# EAGLE schematic RADAR_Main_Board (EAGLE 7.4.0), part 3 of 3
## Sheet 4 of 4: RF POWER AMPLIFIER BIAS
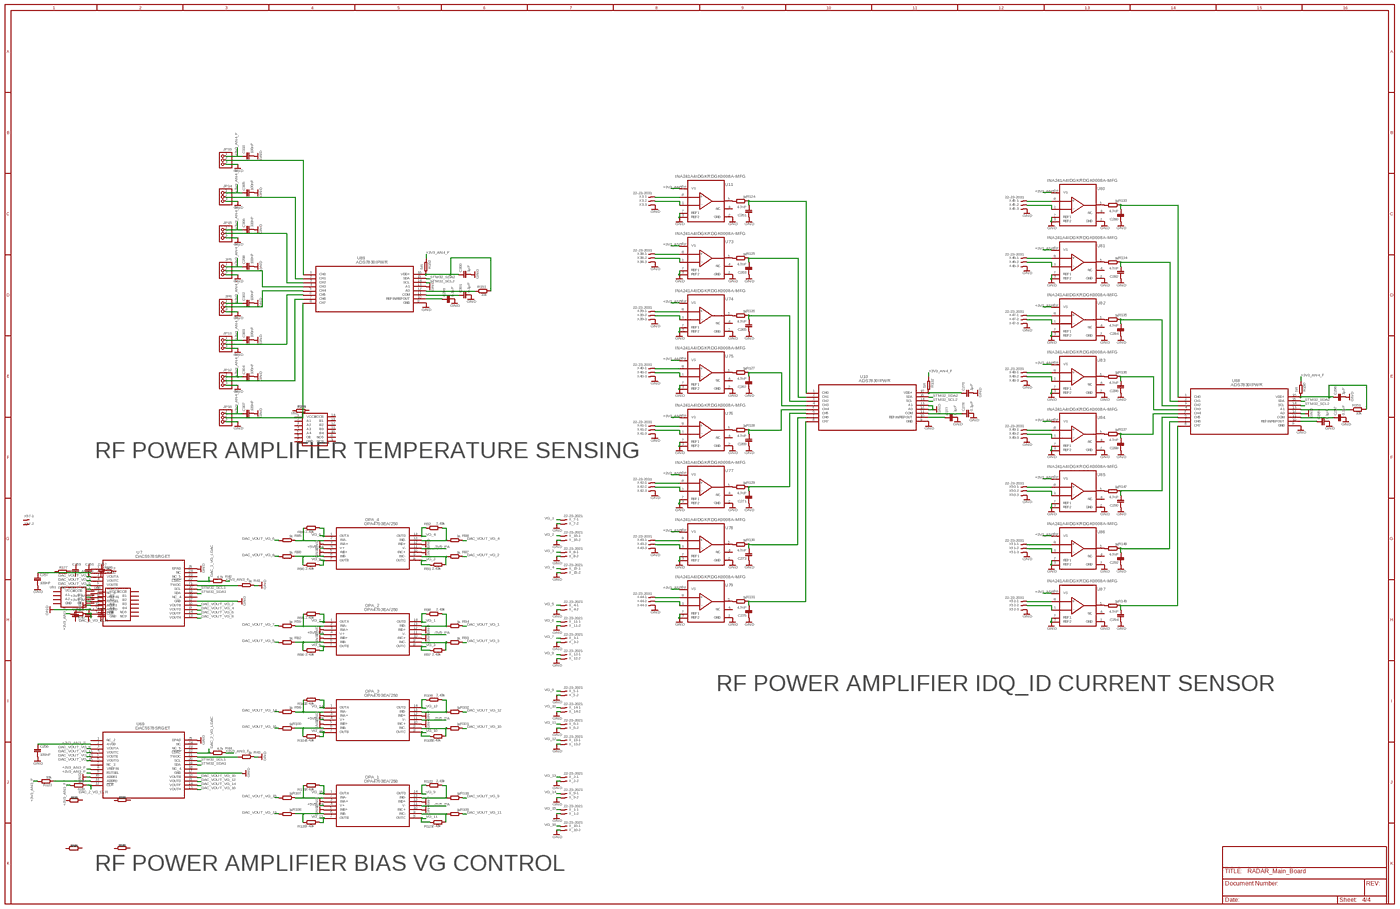
[diagram p16: schematic, sheet 4, overview]
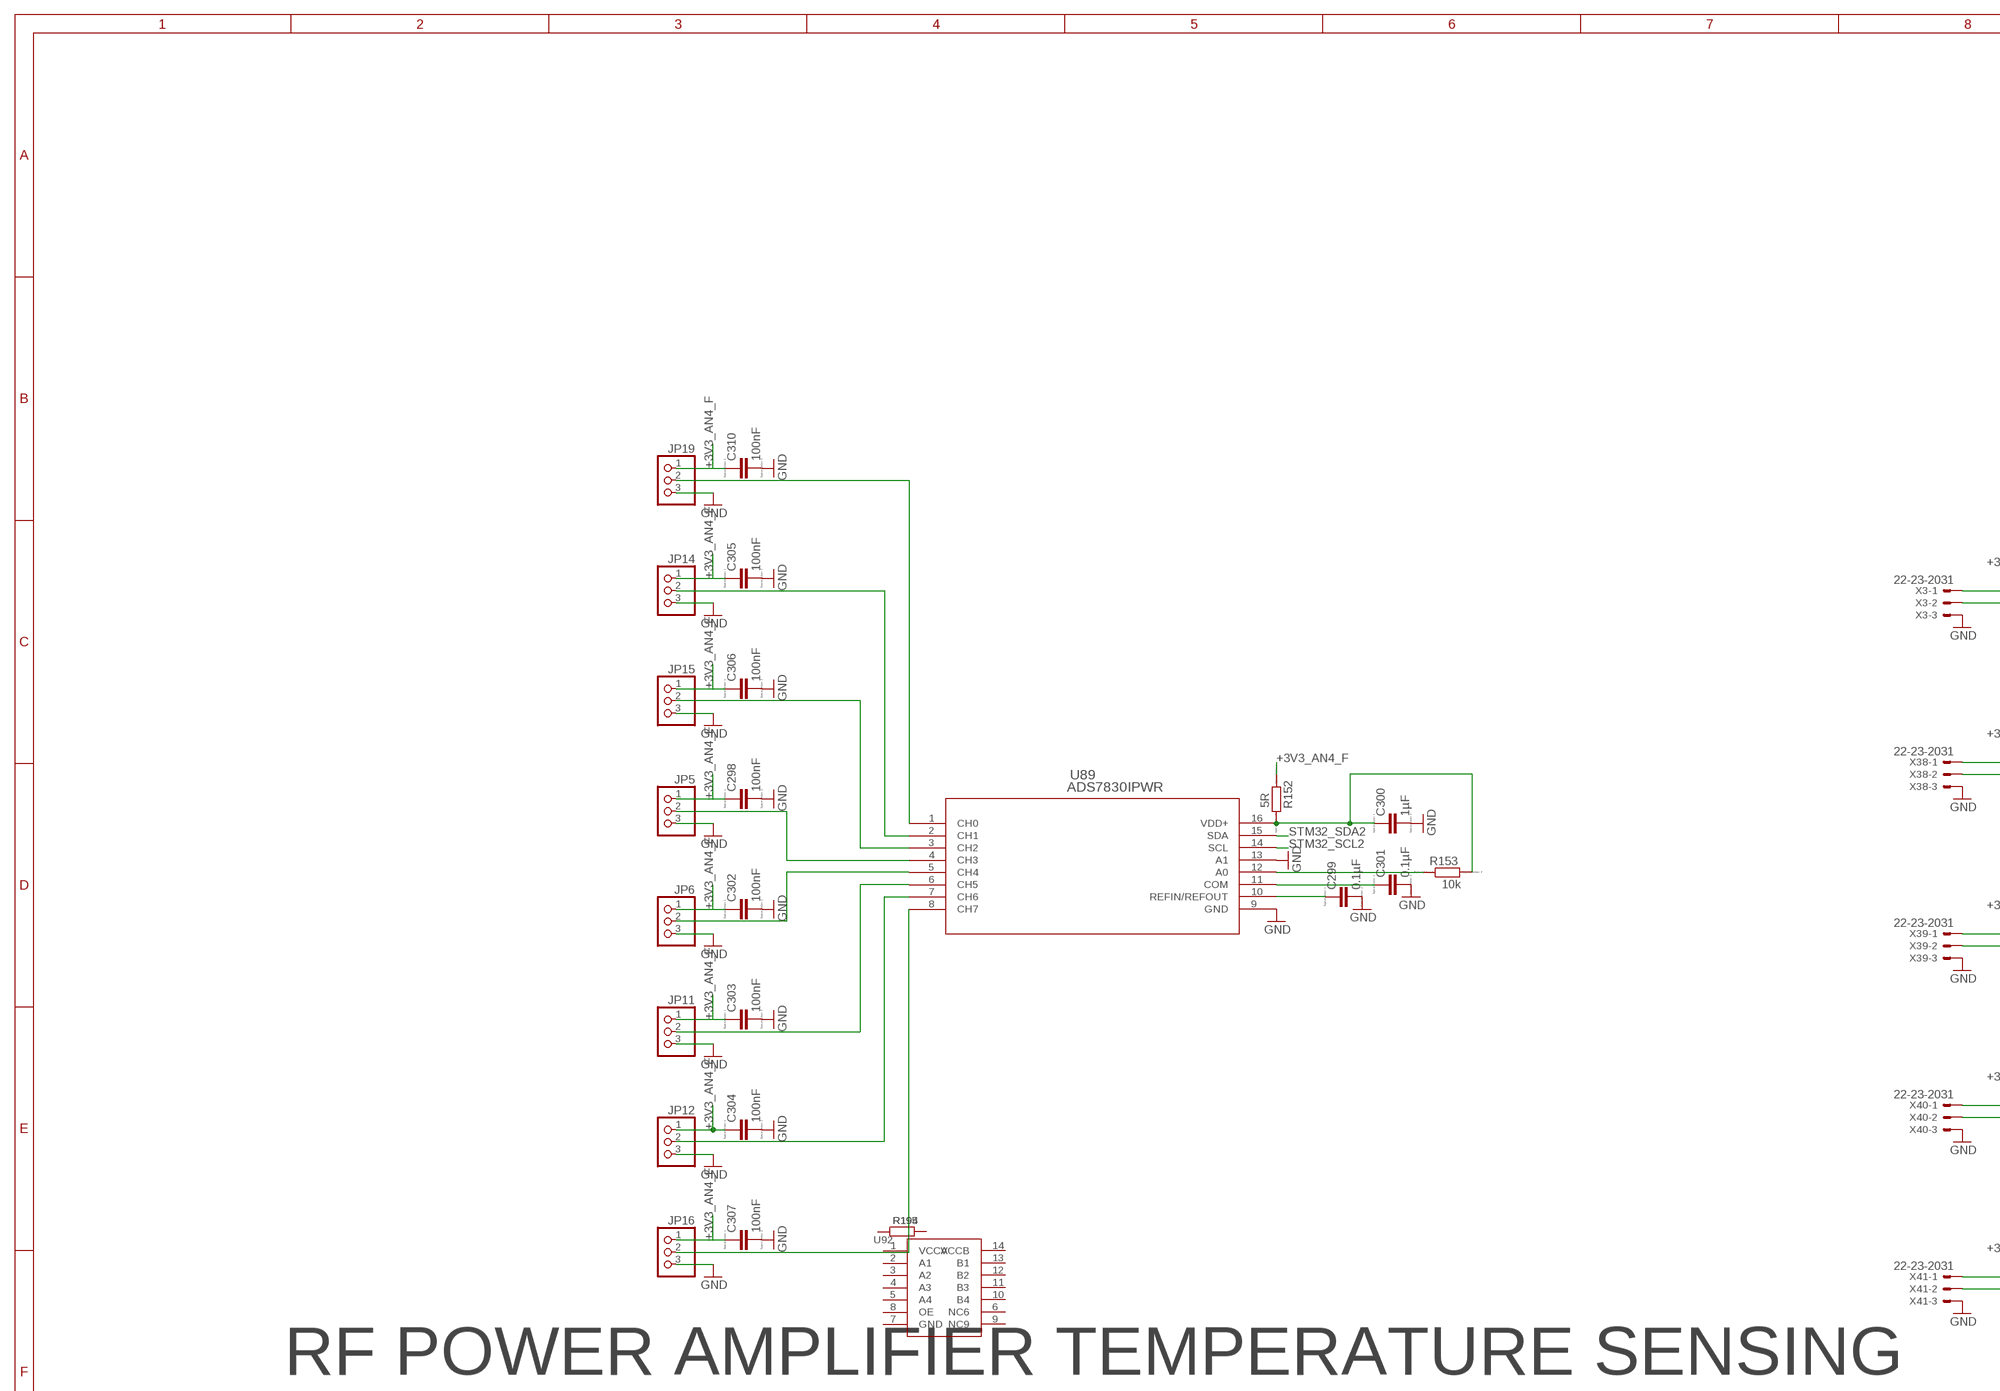
[diagram p17: schematic, sheet 4, part 1 of 4]
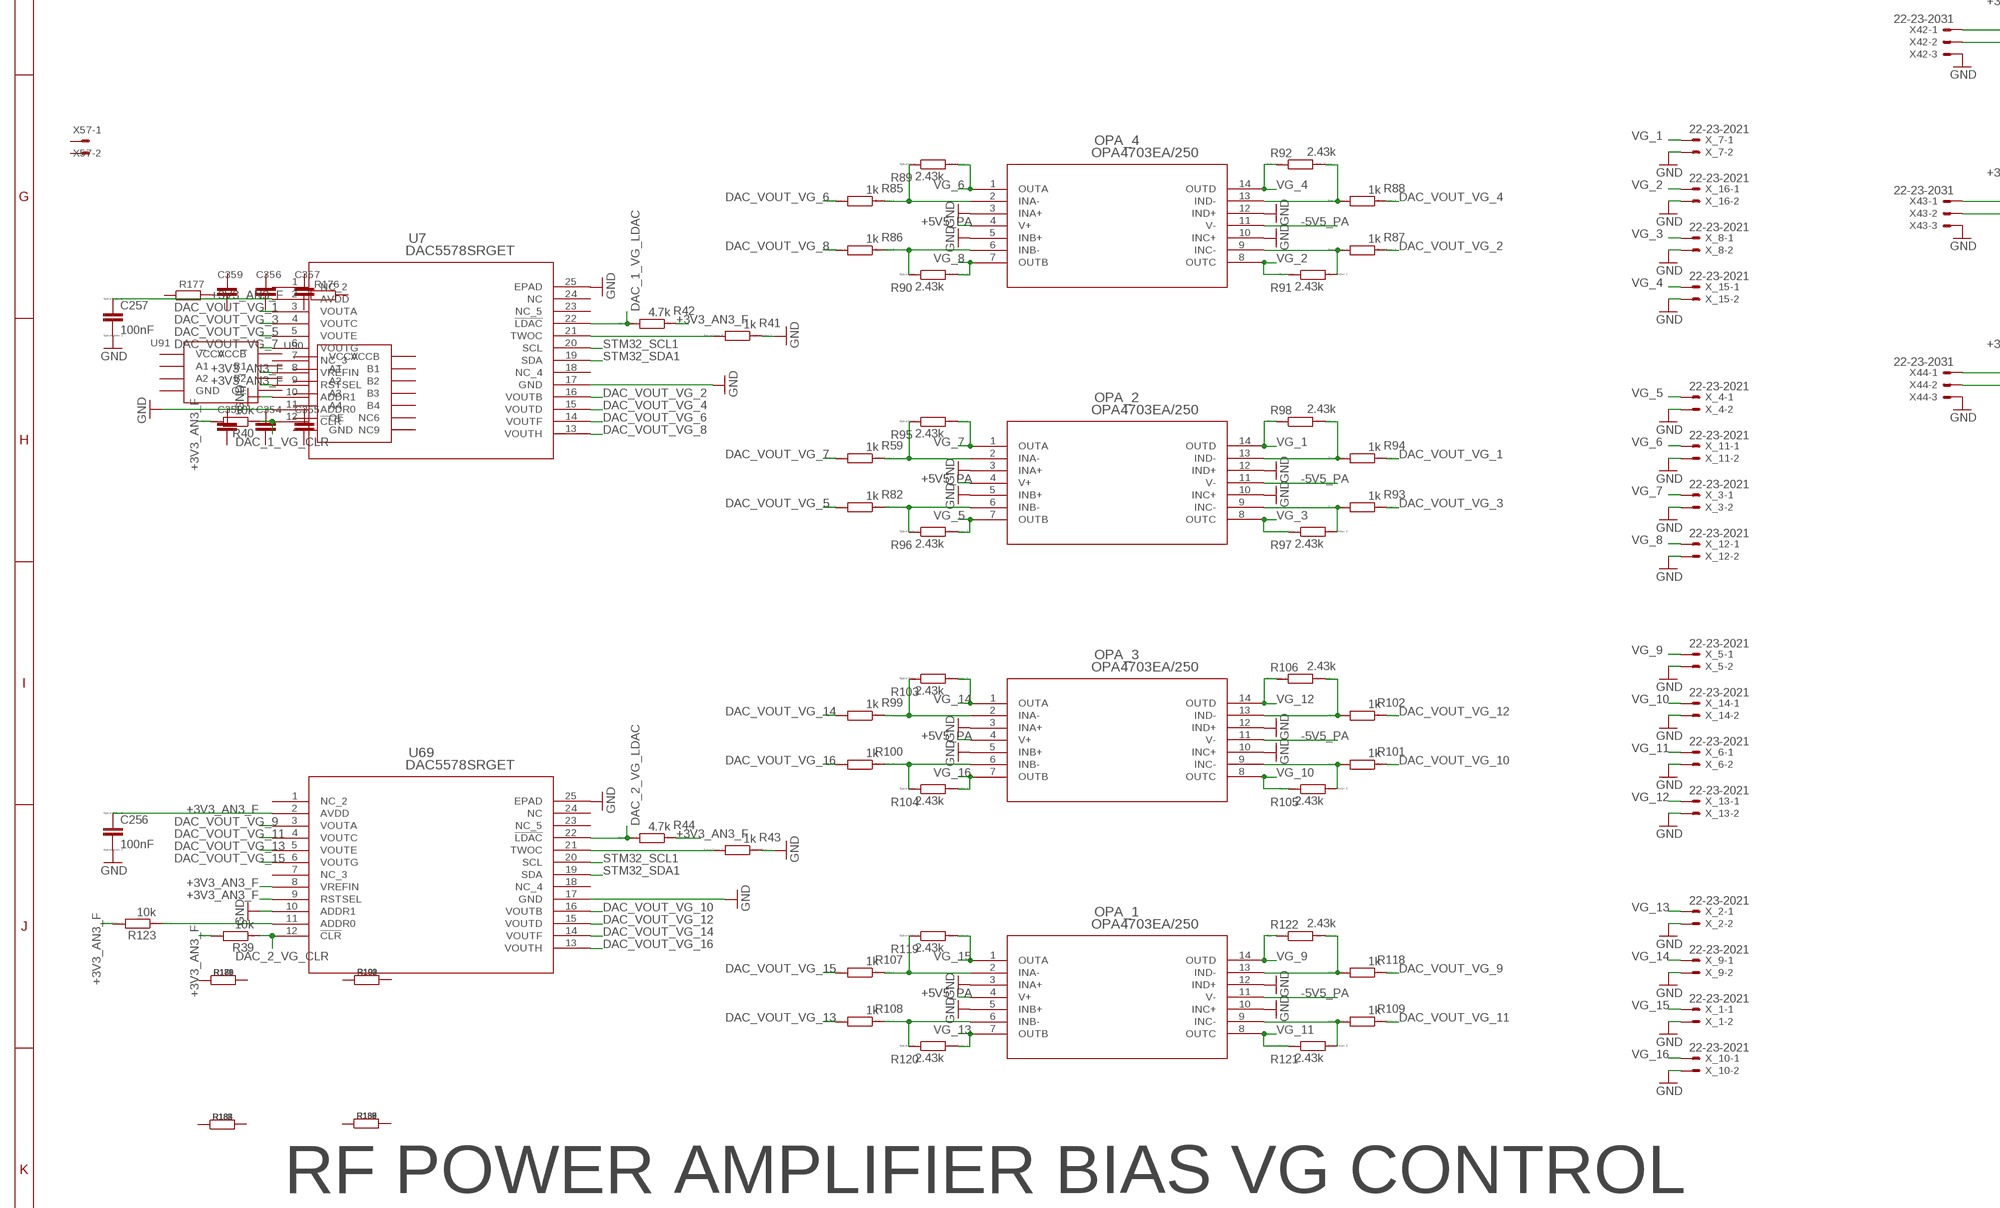
[diagram p18: schematic, sheet 4, part 2 of 4]
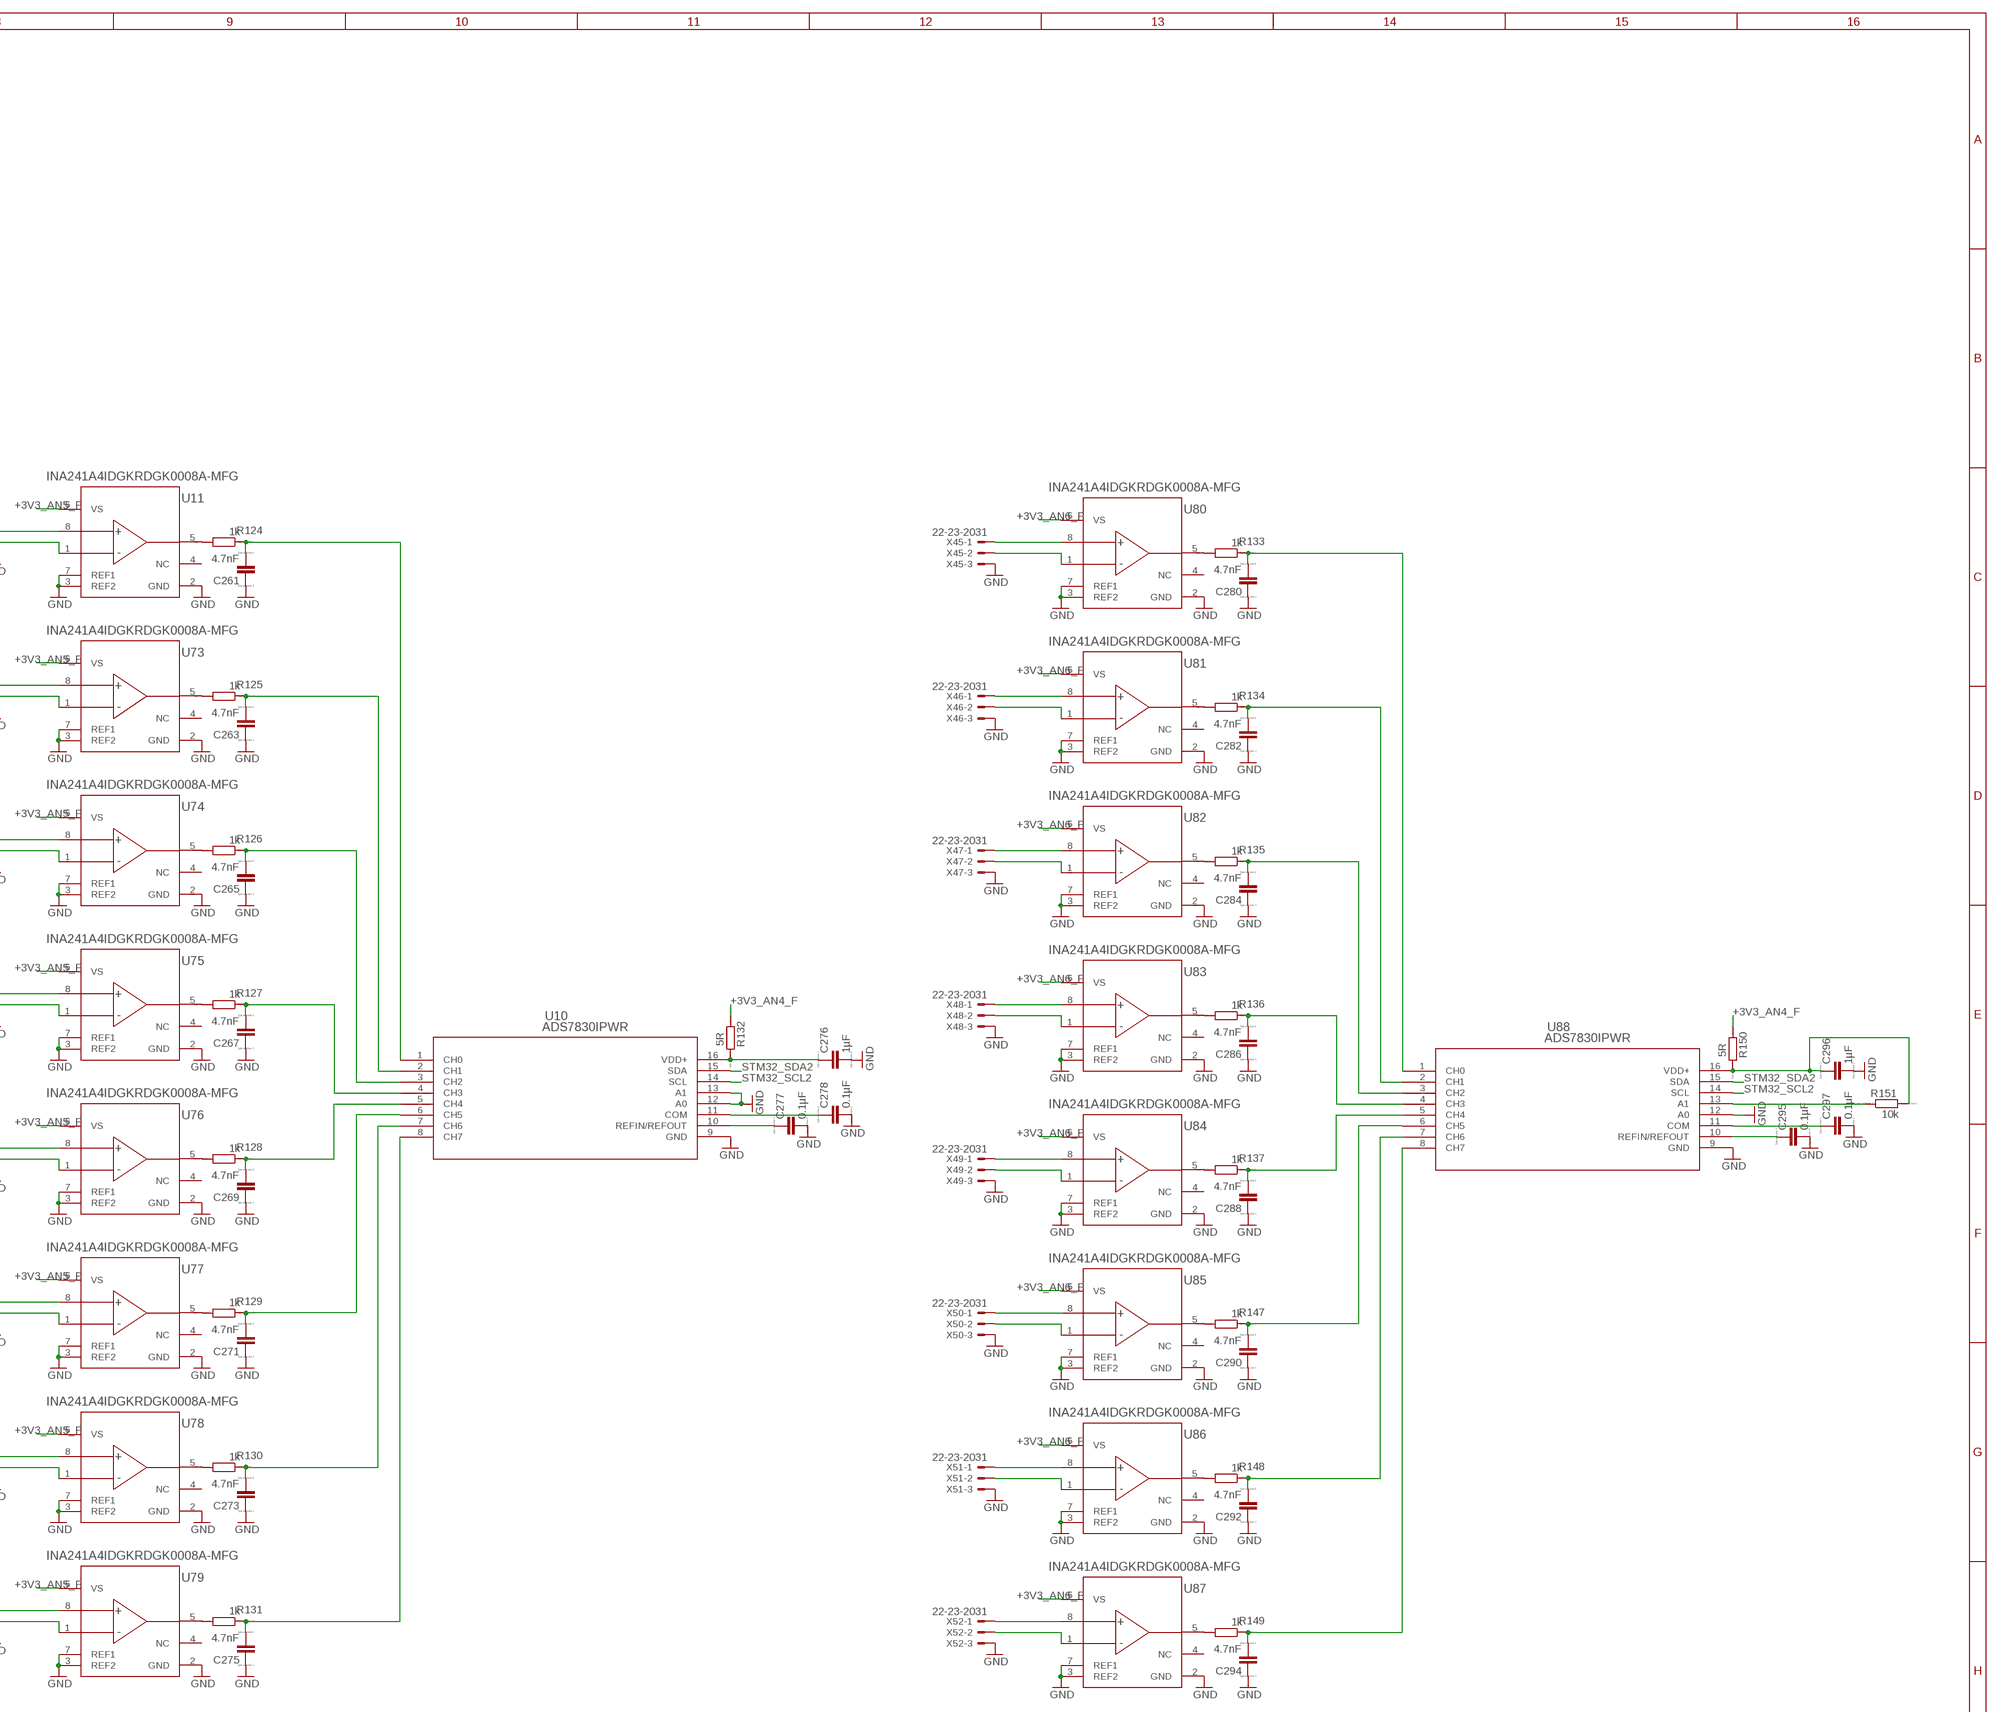
[diagram p19: schematic, sheet 4, part 3 of 4]
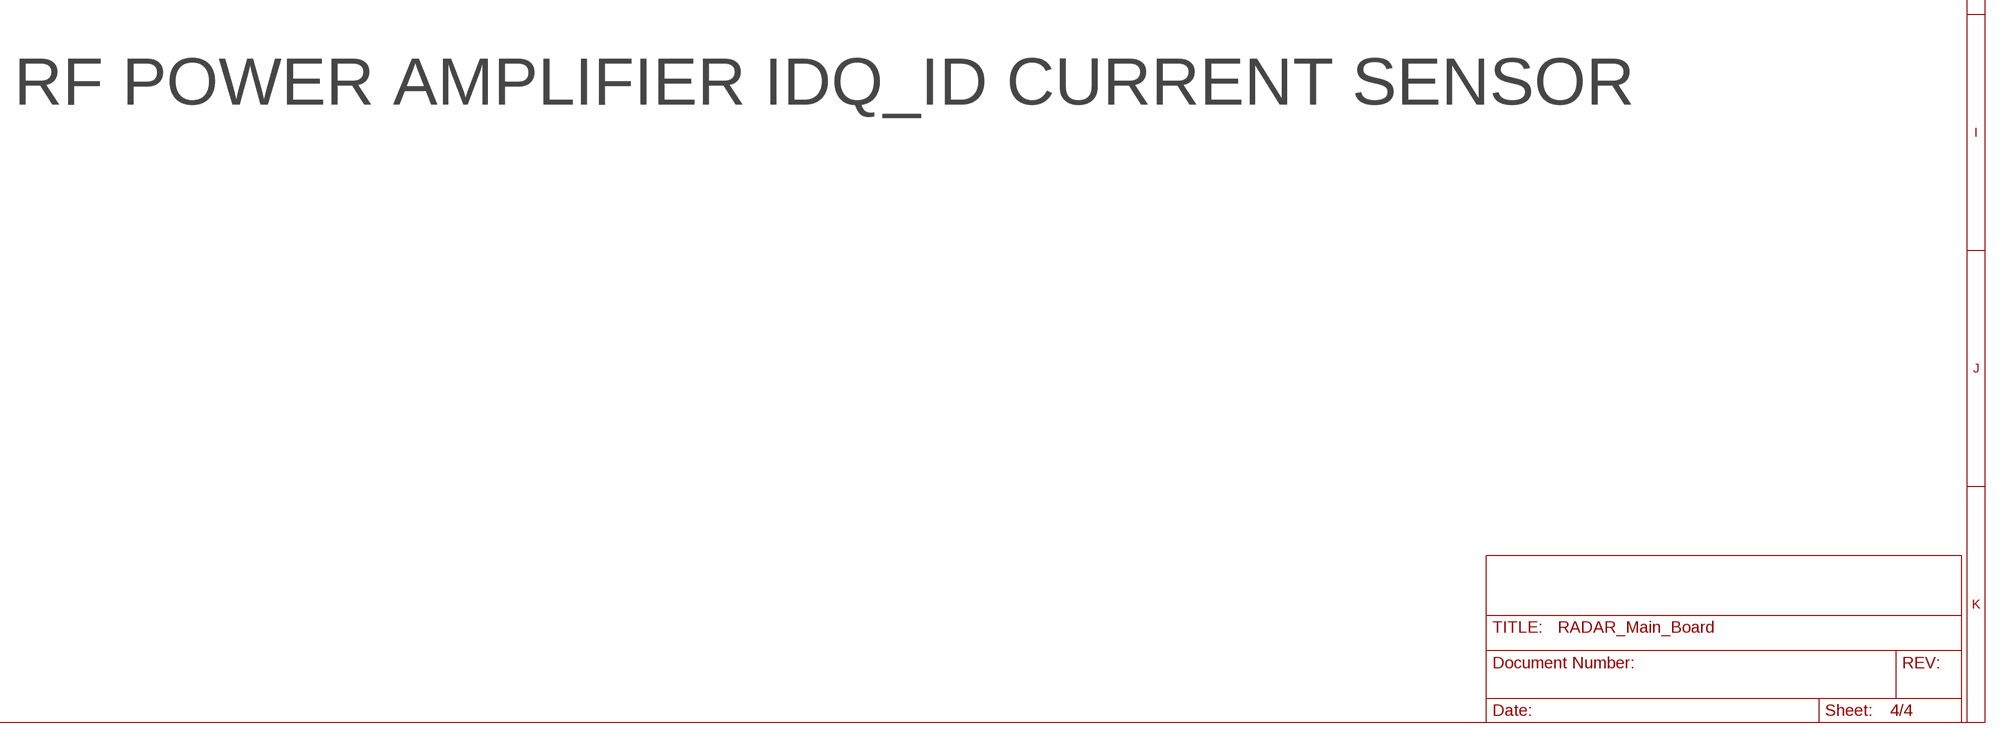
[diagram p20: schematic, sheet 4, part 4 of 4]

### Parts
C256  100nF  CC0201  [C0201]
C257  100nF  CC0201  [C0201]
C261  4.7nF  CC0201  [C0201]
C263  4.7nF  CC0201  [C0201]
C265  4.7nF  CC0201  [C0201]
C267  4.7nF  CC0201  [C0201]
C269  4.7nF  CC0201  [C0201]
C271  4.7nF  CC0201  [C0201]
C273  4.7nF  CC0201  [C0201]
C275  4.7nF  CC0201  [C0201]
C276  1µF  CC0201  [C0201]
C277  0.1µF  CC0201  [C0201]
C278  0.1µF  CC0201  [C0201]
C280  4.7nF  CC0201  [C0201]
C282  4.7nF  CC0201  [C0201]
C284  4.7nF  CC0201  [C0201]
C286  4.7nF  CC0201  [C0201]
C288  4.7nF  CC0201  [C0201]
C290  4.7nF  CC0201  [C0201]
C292  4.7nF  CC0201  [C0201]
C294  4.7nF  CC0201  [C0201]
C295  0.1µF  CC0201  [C0201]
C296  1µF  CC0201  [C0201]
C297  0.1µF  CC0201  [C0201]
C298  100nF  CC0201  [C0201]
C299  0.1µF  CC0201  [C0201]
C300  1µF  CC0201  [C0201]
C301  0.1µF  CC0201  [C0201]
C302  100nF  CC0201  [C0201]
C303  100nF  CC0201  [C0201]
C304  100nF  CC0201  [C0201]
C305  100nF  CC0201  [C0201]
C306  100nF  CC0201  [C0201]
C307  100nF  CC0201  [C0201]
C310  100nF  CC0201  [C0201]
C354  0.1uF  C-EUC0201  [C0201]
C355  0.1uF  C-EUC0201  [C0201]
C356  0.1uF  C-EUC0201  [C0201]
C357  0.1uF  C-EUC0201  [C0201]
C358  0.1uF  C-EUC0201  [C0201]
C359  0.1uF  C-EUC0201  [C0201]
JP5  PINHD-1X3  [1X03]
JP6  PINHD-1X3  [1X03]
JP11  PINHD-1X3  [1X03]
JP12  PINHD-1X3  [1X03]
JP14  PINHD-1X3  [1X03]
JP15  PINHD-1X3  [1X03]
JP16  PINHD-1X3  [1X03]
JP19  PINHD-1X3  [1X03]
OPA_1  OPA4703EA/250  [PW14]
OPA_2  OPA4703EA/250  [PW14]
OPA_3  OPA4703EA/250  [PW14]
OPA_4  OPA4703EA/250  [PW14]
R39  10k  RR0201  [R0201]
R40  10k  RR0201  [R0201]
R41  1k  RR0201  [R0201]
R42  4.7k  RR0201  [R0201]
R43  1k  RR0201  [R0201]
R44  4.7k  RR0201  [R0201]
R59  1k  RR0201  [R0201]
R82  1k  RR0201  [R0201]
R85  1k  RR0201  [R0201]
R86  1k  RR0201  [R0201]
R87  1k  RR0201  [R0201]
R88  1k  RR0201  [R0201]
R89  2.43k  RR0201  [R0201]
R90  2.43k  RR0201  [R0201]
R91  2.43k  RR0201  [R0201]
R92  2.43k  RR0201  [R0201]
R93  1k  RR0201  [R0201]
R94  1k  RR0201  [R0201]
R95  2.43k  RR0201  [R0201]
R96  2.43k  RR0201  [R0201]
R97  2.43k  RR0201  [R0201]
R98  2.43k  RR0201  [R0201]
R99  1k  RR0201  [R0201]
R100  1k  RR0201  [R0201]
R101  1k  RR0201  [R0201]
R102  1k  RR0201  [R0201]
R103  2.43k  RR0201  [R0201]
R104  2.43k  RR0201  [R0201]
R105  2.43k  RR0201  [R0201]
R106  2.43k  RR0201  [R0201]
R107  1k  RR0201  [R0201]
R108  1k  RR0201  [R0201]
R109  1k  RR0201  [R0201]
R118  1k  RR0201  [R0201]
R119  2.43k  RR0201  [R0201]
R120  2.43k  RR0201  [R0201]
R121  2.43k  RR0201  [R0201]
R122  2.43k  RR0201  [R0201]
R123  10k  RR0201  [R0201]
R124  1k  RR0201  [R0201]
R125  1k  RR0201  [R0201]
R126  1k  RR0201  [R0201]
R127  1k  RR0201  [R0201]
R128  1k  RR0201  [R0201]
R129  1k  RR0201  [R0201]
R130  1k  RR0201  [R0201]
R131  1k  RR0201  [R0201]
R132  5R  RR0201  [R0201]
R133  1k  RR0201  [R0201]
R134  1k  RR0201  [R0201]
R135  1k  RR0201  [R0201]
R136  1k  RR0201  [R0201]
R137  1k  RR0201  [R0201]
R147  1k  RR0201  [R0201]
R148  1k  RR0201  [R0201]
R149  1k  RR0201  [R0201]
R150  5R  RR0201  [R0201]
R151  10k  RR0201  [R0201]
R152  5R  RR0201  [R0201]
R153  10k  RR0201  [R0201]
R176  10k  R-EU_R0201  [R0201]
R177  10k  R-EU_R0201  [R0201]
R178  10k  R-EU_R0201  [R0201]
R179  10k  R-EU_R0201  [R0201]
R180  10k  R-EU_R0201  [R0201]
R181  10k  R-EU_R0201  [R0201]
R182  10k  R-EU_R0201  [R0201]
R183  10k  R-EU_R0201  [R0201]
R184  10k  R-EU_R0201  [R0201]
R185  10k  R-EU_R0201  [R0201]
R186  10k  R-EU_R0201  [R0201]
R187  10k  R-EU_R0201  [R0201]
R188  10k  R-EU_R0201  [R0201]
R189  10k  R-EU_R0201  [R0201]
R190  10k  R-EU_R0201  [R0201]
R191  10k  R-EU_R0201  [R0201]
R192  10k  R-EU_R0201  [R0201]
R193  10k  R-EU_R0201  [R0201]
R194  10k  R-EU_R0201  [R0201]
R195  4.7k  R-EU_R0201  [R0201]
R196  10k  R-EU_R0201  [R0201]  (not placed on a sheet)
R197  10k  R-EU_R0201  [R0201]  (not placed on a sheet)
R198  10k  R-EU_R0201  [R0201]  (not placed on a sheet)
R199  10k  R-EU_R0201  [R0201]  (not placed on a sheet)
R200  10k  R-EU_R0201  [R0201]  (not placed on a sheet)
R201  10k  R-EU_R0201  [R0201]  (not placed on a sheet)
R202  10k  R-EU_R0201  [R0201]  (not placed on a sheet)
R203  10k  R-EU_R0201  [R0201]  (not placed on a sheet)
U7  DAC5578SRGET  [RGE24_2P7X2P7]
U10  ADS7830IPWR  [PW16]
U11  INA241A4IDGKRDGK0008A-MFG  [DGK0008A-MFG]
U69  DAC5578SRGET  [RGE24_2P7X2P7]
U73  INA241A4IDGKRDGK0008A-MFG  [DGK0008A-MFG]
U74  INA241A4IDGKRDGK0008A-MFG  [DGK0008A-MFG]
U75  INA241A4IDGKRDGK0008A-MFG  [DGK0008A-MFG]
U76  INA241A4IDGKRDGK0008A-MFG  [DGK0008A-MFG]
U77  INA241A4IDGKRDGK0008A-MFG  [DGK0008A-MFG]
U78  INA241A4IDGKRDGK0008A-MFG  [DGK0008A-MFG]
U79  INA241A4IDGKRDGK0008A-MFG  [DGK0008A-MFG]
U80  INA241A4IDGKRDGK0008A-MFG  [DGK0008A-MFG]
U81  INA241A4IDGKRDGK0008A-MFG  [DGK0008A-MFG]
U82  INA241A4IDGKRDGK0008A-MFG  [DGK0008A-MFG]
U83  INA241A4IDGKRDGK0008A-MFG  [DGK0008A-MFG]
U84  INA241A4IDGKRDGK0008A-MFG  [DGK0008A-MFG]
U85  INA241A4IDGKRDGK0008A-MFG  [DGK0008A-MFG]
U86  INA241A4IDGKRDGK0008A-MFG  [DGK0008A-MFG]
U87  INA241A4IDGKRDGK0008A-MFG  [DGK0008A-MFG]
U88  ADS7830IPWR  [PW16]
U89  ADS7830IPWR  [PW16]
U90  TXS0104EPWRPW0014A-MFG  (no package)
U91  TXS0102DCURDCU0008A-MFG  (no package)
U92  TXS0104EPWR  [PW0014A-MFG]
X3  22-23-2031  [22-23-2031]
X38  22-23-2031  [22-23-2031]
X39  22-23-2031  [22-23-2031]
X40  22-23-2031  [22-23-2031]
X41  22-23-2031  [22-23-2031]
X42  22-23-2031  [22-23-2031]
X43  22-23-2031  [22-23-2031]
X44  22-23-2031  [22-23-2031]
X45  22-23-2031  [22-23-2031]
X46  22-23-2031  [22-23-2031]
X47  22-23-2031  [22-23-2031]
X48  22-23-2031  [22-23-2031]
X49  22-23-2031  [22-23-2031]
X50  22-23-2031  [22-23-2031]
X51  22-23-2031  [22-23-2031]
X52  22-23-2031  [22-23-2031]
X57  22-23-202122-23-2021  (no package)
X_1  22-23-2021  [22-23-2021]
X_2  22-23-2021  [22-23-2021]
X_3  22-23-2021  [22-23-2021]
X_4  22-23-2021  [22-23-2021]
X_5  22-23-2021  [22-23-2021]
X_6  22-23-2021  [22-23-2021]
X_7  22-23-2021  [22-23-2021]
X_8  22-23-2021  [22-23-2021]
X_9  22-23-2021  [22-23-2021]
X_10  22-23-2021  [22-23-2021]
X_11  22-23-2021  [22-23-2021]
X_12  22-23-2021  [22-23-2021]
X_13  22-23-2021  [22-23-2021]
X_14  22-23-2021  [22-23-2021]
X_15  22-23-2021  [22-23-2021]
X_16  22-23-2021  [22-23-2021]

### Nets
+3V3_AN3_F: C256.1 C257.1 R39.2 R40.2 R42.1 R44.1 R123.2 U7.2(AVDD) U7.8(VREFIN) U7.9(RSTSEL) U69.2(AVDD) U69.8(VREFIN) U69.9(RSTSEL) ; also sheet 1
+3V3_AN4_F: C298.1 C302.1 C303.1 C304.1 C305.1 C306.1 C307.1 C310.1 JP5.1 JP6.1 JP11.1 JP12.1 JP14.1 JP15.1 JP16.1 JP19.1 R132.1 R150.1 R152.1 ; also sheet 1
+3V3_AN5_F: U11.6(VS) U73.6(VS) U74.6(VS) U75.6(VS) U76.6(VS) U77.6(VS) U78.6(VS) U79.6(VS) ; also sheet 1
+3V3_AN6_F: U80.6(VS) U81.6(VS) U82.6(VS) U83.6(VS) U84.6(VS) U85.6(VS) U86.6(VS) U87.6(VS) ; also sheet 1
+5V5_PA: OPA_1.4(V+) OPA_2.4(V+) OPA_3.4(V+) OPA_4.4(V+) ; also sheet 1
DAC_1_VG_CLR: R40.1 U7.12(!CLR) ; also sheet 2
DAC_1_VG_LDAC: R42.2 U7.22(!LDAC) ; also sheet 2
DAC_2_VG_CLR: R39.1 U69.12(!CLR) ; also sheet 2
DAC_2_VG_LDAC: R44.2 U69.22(!LDAC) ; also sheet 2
DAC_VOUT_VG_1: R94.1 U7.3(VOUTA)
DAC_VOUT_VG_2: R87.1 U7.16(VOUTB)
DAC_VOUT_VG_3: R93.1 U7.4(VOUTC)
DAC_VOUT_VG_4: R88.1 U7.15(VOUTD)
DAC_VOUT_VG_5: R82.2 U7.5(VOUTE)
DAC_VOUT_VG_6: R85.2 U7.14(VOUTF)
DAC_VOUT_VG_7: R59.2 U7.6(VOUTG)
DAC_VOUT_VG_8: R86.2 U7.13(VOUTH)
DAC_VOUT_VG_9: R118.1 U69.3(VOUTA)
DAC_VOUT_VG_10: R101.1 U69.16(VOUTB)
DAC_VOUT_VG_11: R109.1 U69.4(VOUTC)
DAC_VOUT_VG_12: R102.1 U69.15(VOUTD)
DAC_VOUT_VG_13: R108.2 U69.5(VOUTE)
DAC_VOUT_VG_14: R99.2 U69.14(VOUTF)
DAC_VOUT_VG_15: R107.2 U69.6(VOUTG)
DAC_VOUT_VG_16: R100.2 U69.13(VOUTH)
GND: C256.2 C257.2 C261.1 C263.1 C265.1 C267.1 C269.1 C271.1 C273.1 C275.1 C276.2 C277.2 C278.2 C280.1 C282.1 C284.1 C286.1 C288.1 C290.1 C292.1 C294.1 C295.2 C296.2 C297.2 C298.2 C299.2 C300.2 C301.2 C302.2 C303.2 C304.2 C305.2 C306.2 C307.2 C310.2 JP5.3 JP6.3 JP11.3 JP12.3 JP14.3 JP15.3 JP16.3 JP19.3 OPA_1.3(INA+) OPA_1.5(INB+) OPA_1.10(INC+) OPA_1.12(IND+) OPA_2.3(INA+) OPA_2.5(INB+) OPA_2.10(INC+) OPA_2.12(IND+) OPA_3.3(INA+) OPA_3.5(INB+) OPA_3.10(INC+) OPA_3.12(IND+) OPA_4.3(INA+) OPA_4.5(INB+) OPA_4.10(INC+) OPA_4.12(IND+) R41.1 R43.1 U7.10(ADDR1) U7.11(ADDR0) U7.17(GND) U7.25(EPAD) U10.9(GND) U10.12(A0) U10.13(A1) U11.2(GND) U11.3(REF2) U11.7(REF1) U69.10(ADDR1) U69.17(GND) U69.25(EPAD) U73.2(GND) U73.3(REF2) U73.7(REF1) U74.2(GND) U74.3(REF2) U74.7(REF1) U75.2(GND) U75.3(REF2) U75.7(REF1) U76.2(GND) U76.3(REF2) U76.7(REF1) U77.2(GND) U77.3(REF2) U77.7(REF1) U78.2(GND) U78.3(REF2) U78.7(REF1) U79.2(GND) U79.3(REF2) U79.7(REF1) U80.2(GND) U80.3(REF2) U80.7(REF1) U81.2(GND) U81.3(REF2) U81.7(REF1) U82.2(GND) U82.3(REF2) U82.7(REF1) U83.2(GND) U83.3(REF2) U83.7(REF1) U84.2(GND) U84.3(REF2) U84.7(REF1) U85.2(GND) U85.3(REF2) U85.7(REF1) U86.2(GND) U86.3(REF2) U86.7(REF1) U87.2(GND) U87.3(REF2) U87.7(REF1) U88.9(GND) U88.12(A0) U89.9(GND) U89.13(A1) X3.3 X38.3 X39.3 X40.3 X41.3 X42.3 X43.3 X44.3 X45.3 X46.3 X47.3 X48.3 X49.3 X50.3 X51.3 X52.3 X_1.2 X_2.2 X_3.2 X_4.2 X_5.2 X_6.2 X_7.2 X_8.2 X_9.2 X_10.2 X_11.2 X_12.2 X_13.2 X_14.2 X_15.2 X_16.2 ; also sheet 1,2,3
N$1: R123.1 U69.11(ADDR0)
N$205: R43.2 U69.21(TWOC)
N$206: OPA_4.2(INA-) R85.1 R89.1
N$207: U11.8(IN+) X3.1
N$208: OPA_4.6(INB-) R86.1 R90.1
N$209: U11.1(IN-) X3.2
N$210: R124.2 U11.5(OUT)
N$211: C261.2 R124.1 U10.1(CH0)
N$212: U73.8(IN+) X38.1
N$213: OPA_4.9(INC-) R87.2 R91.2
N$214: U73.1(IN-) X38.2
N$215: R125.2 U73.5(OUT)
N$216: OPA_4.13(IND-) R88.2 R92.2
N$217: C263.2 R125.1 U10.2(CH1)
N$218: U74.8(IN+) X39.1
N$219: U74.1(IN-) X39.2
N$220: R126.2 U74.5(OUT)
N$221: R41.2 U7.21(TWOC)
N$222: OPA_2.2(INA-) R59.1 R95.1
N$223: C265.2 R126.1 U10.3(CH2)
N$224: OPA_2.6(INB-) R82.1 R96.1
N$225: U75.8(IN+) X40.1
N$226: U75.1(IN-) X40.2
N$227: R127.2 U75.5(OUT)
N$228: OPA_2.9(INC-) R93.2 R97.2
N$229: C267.2 R127.1 U10.4(CH3)
N$230: U76.8(IN+) X41.1
N$231: OPA_2.13(IND-) R94.2 R98.2
N$232: U76.1(IN-) X41.2
N$233: R128.2 U76.5(OUT)
N$234: C269.2 R128.1 U10.5(CH4)
N$235: U77.8(IN+) X42.1
N$236: U77.1(IN-) X42.2
N$237: R129.2 U77.5(OUT)
N$238: OPA_3.2(INA-) R99.1 R103.1
N$239: C271.2 R129.1 U10.6(CH5)
N$240: OPA_3.6(INB-) R100.1 R104.1
N$241: U78.8(IN+) X43.1
N$242: U78.1(IN-) X43.2
N$243: R130.2 U78.5(OUT)
N$244: OPA_3.9(INC-) R101.2 R105.2
N$245: C273.2 R130.1 U10.7(CH6)
N$246: U79.8(IN+) X44.1
N$247: OPA_3.13(IND-) R102.2 R106.2
N$248: U79.1(IN-) X44.2
N$249: R131.2 U79.5(OUT)
N$250: C275.2 R131.1 U10.8(CH7)
N$251: C277.1 U10.10(REFIN/REFOUT)
N$252: C276.1 R132.2 U10.16(VDD+)
N$253: C278.1 U10.11(COM)
N$254: OPA_1.2(INA-) R107.1 R119.1
N$255: U80.8(IN+) X45.1
N$256: OPA_1.6(INB-) R108.1 R120.1
N$257: U80.1(IN-) X45.2
N$258: R133.2 U80.5(OUT)
N$259: C280.2 R133.1 U88.1(CH0)
N$260: OPA_1.9(INC-) R109.2 R121.2
N$261: U81.8(IN+) X46.1
N$262: U81.1(IN-) X46.2
N$263: OPA_1.13(IND-) R118.2 R122.2
N$264: R134.2 U81.5(OUT)
N$265: C282.2 R134.1 U88.2(CH1)
N$266: U82.8(IN+) X47.1
N$267: U82.1(IN-) X47.2
N$268: R135.2 U82.5(OUT)
N$269: C284.2 R135.1 U88.3(CH2)
N$270: U83.8(IN+) X48.1
N$271: U83.1(IN-) X48.2
N$272: R136.2 U83.5(OUT)
N$273: C286.2 R136.1 U88.4(CH3)
N$274: U84.8(IN+) X49.1
N$275: U84.1(IN-) X49.2
N$276: R137.2 U84.5(OUT)
N$277: C288.2 R137.1 U88.5(CH4)
N$278: U85.8(IN+) X50.1
N$279: U85.1(IN-) X50.2
N$280: R147.2 U85.5(OUT)
N$281: C290.2 R147.1 U88.6(CH5)
N$282: U86.8(IN+) X51.1
N$283: U86.1(IN-) X51.2
N$284: R148.2 U86.5(OUT)
N$285: C292.2 R148.1 U88.7(CH6)
N$286: U87.8(IN+) X52.1
N$287: U87.1(IN-) X52.2
N$288: R149.2 U87.5(OUT)
N$289: C294.2 R149.1 U88.8(CH7)
N$290: C295.1 U88.10(REFIN/REFOUT)
N$291: C296.1 R150.2 R151.2 U88.16(VDD+)
N$292: C297.1 U88.11(COM)
N$293: R151.1 U88.13(A1)
N$294: R153.1 U89.12(A0)
N$302: C299.1 U89.10(REFIN/REFOUT)
N$303: C300.1 R152.2 R153.2 U89.16(VDD+)
N$304: C301.1 U89.11(COM)
STM32_SCL1 [Single_Ended Clocks & RF]: U7.20(SCL) U69.20(SCL) ; also sheet 2
STM32_SCL2 [Single_Ended Clocks & RF]: U10.14(SCL) U88.14(SCL) U89.14(SCL) ; also sheet 2
STM32_SDA1: U7.19(SDA) U69.19(SDA) ; also sheet 2
STM32_SDA2: U10.15(SDA) U88.15(SDA) U89.15(SDA) ; also sheet 2
TEMP_1: JP19.2 U89.1(CH0)
TEMP_2: JP14.2 U89.2(CH1)
TEMP_3: JP15.2 U89.3(CH2)
TEMP_4: JP5.2 U89.4(CH3)
TEMP_5: JP6.2 U89.5(CH4)
TEMP_6: JP11.2 U89.6(CH5)
TEMP_7: JP12.2 U89.7(CH6)
TEMP_8: JP16.2 U89.8(CH7)
VG_1: OPA_2.14(OUTD) R98.1 R178.1 X_7.1
VG_2: OPA_4.8(OUTC) R91.1 R190.1 X_16.1
VG_3: OPA_2.8(OUTC) R97.1 R179.1 X_8.1
VG_4: OPA_4.14(OUTD) R92.1 R191.1 X_15.1
VG_5: OPA_2.7(OUTB) R96.2 R180.1 X_4.1
VG_6: OPA_4.1(OUTA) R89.2 R192.1 X_11.1
VG_7: OPA_2.1(OUTA) R95.2 R181.1 X_3.1
VG_8: OPA_4.7(OUTB) R90.2 R193.1 X_12.1
VG_9: OPA_1.14(OUTD) R122.1 R182.1 X_5.1
VG_10: OPA_3.8(OUTC) R105.1 R186.1 X_14.1
VG_11: OPA_1.8(OUTC) R121.1 R183.1 X_6.1
VG_12: OPA_3.14(OUTD) R106.1 R187.1 X_13.1
VG_13: OPA_1.7(OUTB) R120.2 R184.1 X_2.1
VG_14: OPA_3.1(OUTA) R103.2 R188.1 X_9.1
VG_15: OPA_1.1(OUTA) R119.2 R185.1 X_1.1
VG_16: OPA_3.7(OUTB) R104.2 R189.1 X_10.1
Unconnected: R196.1 R196.2 R197.1 R197.2 R198.1 R198.2 R199.1 R199.2 R200.1 R200.2 R201.1 R201.2 R202.1 R202.2 R203.1 R203.2 U7.1(NC_2) U7.7(NC_3) U7.18(NC_4) U7.23(NC_5) U7.24(NC) U11.4(NC) U69.1(NC_2) U69.7(NC_3) U69.18(NC_4) U69.23(NC_5) U69.24(NC) U73.4(NC) U74.4(NC) U75.4(NC) U76.4(NC) U77.4(NC) U78.4(NC) U79.4(NC) U80.4(NC) U81.4(NC) U82.4(NC) U83.4(NC) U84.4(NC) U85.4(NC) U86.4(NC) U87.4(NC) U90.NC6 U90.NC9 U92.5(A4) U92.6(NC6) U92.9(NC9) U92.10(B4)

### Notes on the sheet
- RF POWER AMPLIFIER TEMPERATURE SENSING
- RF POWER AMPLIFIER IDQ_ID CURRENT SENSOR
- RF POWER AMPLIFIER BIAS VG CONTROL

## Library data of the parts
ADAR1_ ADAR2_ ADAR3_ ADAR4_ = My_Library_RADAR:ADAR1000ACCZN; COPYRIGHT: Copyright (C) 2024 Ultra Librarian. All rights reserved.; MANUFACTURER_PART_NUMBER: ADAR1000ACCZN; MFR_NAME: Analog Devices Inc; TYPE: RF
ADTR1107_1-ADTR1107_16 = My_Library_RADAR:ADTR1107ACCZ; COPYRIGHT: Copyright (C) 2024 Ultra Librarian. All rights reserved.; MANUFACTURER_PART_NUMBER: ADTR1107ACCZ; MFR_NAME: Analog Devices Inc; TYPE: RF
C1 C2 C4-C42 C44-C47 C50-C53 C55 C56 C59-C74 C79-C185 C188-C257 C261 C263 C265 C267-C282 C284-C310 C352 C353 = eagle-ltspice:C: CAPACITOR, European symbol; SPICEMODEL: NONE; SPICEPREFIX: C
C3 C43 C48 C49 C54 C57 C58 C75-C78 C258-C260 C262 C264 C266 C283 C311-C351 C354-C359 = rcl:C-EU: CAPACITOR, European symbol; SPICEPREFIX: C
C186 C187 = SparkFun-Capacitors:4.7UF-POLAR; PROD_ID: CAP-13916
D2-D5 = SparkFun-LED:LED-BLUE: Blue SMD LED Used in manufacturing of various products at SparkFun Packages: 0603 - SMD 0603 package [Product Link] <http://www.digikey.com/product-detail/en/SMLE12BC7TT86/511-1589-2-ND/1641808> 1206 - SMD1206 package [Product Link] <http://www.digikey.com/product-detail/en/lite-on-inc/LTST-C150TBKT/160-1643-1-ND/573584> SparkFun Products: ESP8266 Thing-Dev Board <https://www.sparkfun.com/products/13711> RedBoard <https://www.sparkfun.com/products/12757>; PROD_ID: DIO-08575
IC1 = atmel:AT93C46A-10?Q-2.7: Three-wire Automotive Temperature Serial EEPROM 1K (64 x 16) Source: http://www.atmel.com/dyn/resources/prod_documents/doc5089.pdf; MPN: AT93C46DN-SH-B; OC_FARNELL: 1455086; OC_NEWARK: 58M3879
J1 J18 J20 J22-J59 = 142-0731-211:142-0731-211: SMA Connector Jack, Female Socket 50 Ohms Through Hole Solder Source: Datasheet <https://www.cinch.com/media/drawings/products/rf-microwave/connectors/dr-CCS-JOHNS-142-0731-211.pdf>; DESCRIPTION: SMA Connector Jack, Female Socket 50 Ohms Through Hole Solder; HEIGHT: 9.8852mm; MANUFACTURER_NAME: Cinch Connectivity Solutions; MANUFACTURER_PART_NUMBER: 142-0731-211; MOUSER_PART_NUMBER: 530-142-0731-211; MOUSER_PRICE-STOCK: https://www.mouser.co.uk/ProductDetail/Johnson-Cinch-Connectivity-Solutions/142-0731-211?qs=HFfMDpzxxd0OVzI3hm9tuA%3D%3D
J19 J21 = CJT-T-P-HH-ST-TH1:CJT-T-P-HH-ST-TH1: Conn Twinax F 0Hz to 4GHz 100Ohm Solder ST Thru-Hole Gold Source: Datasheet <https://www.samtec.com/partnumber/CJT-T-P-HH-ST-TH1>; DESCRIPTION: Conn Twinax F 0Hz to 4GHz 100Ohm Solder ST Thru-Hole Gold; HEIGHT: 7.31mm; MANUFACTURER_NAME: SAMTEC; MANUFACTURER_PART_NUMBER: CJT-T-P-HH-ST-TH1; MOUSER_PART_NUMBER: 200-CJTTPHHSTTH1; MOUSER_PRICE-STOCK: https://www.mouser.co.uk/ProductDetail/Samtec/CJT-T-P-HH-ST-TH1?qs=PB6%2FjmICvI3dfW8RDpxn0g%3D%3D
JP1 = pinhead:PINHD-2X6: PIN HEADER
JP2 = pinhead:PINHD-1X6: PIN HEADER
JP3 = pinhead:PINHD-2X4: PIN HEADER
JP4-JP6 JP10-JP12 JP14-JP17 JP19 = pinhead:PINHD-1X3: PIN HEADER
JP7 = pinhead:PINHD-1X8: PIN HEADER
JP8 JP9 JP18 = pinhead:PINHD-1X4: PIN HEADER
JP13 = pinhead:PINHD-2X7: PIN HEADER
JP20 = pinhead:PINHD-1X2: PIN HEADER
L1 L11-L18 L21 L23 = rcl:L-EU: INDUCTOR, European symbol; SPICEPREFIX: L
L2-L4 L8-L10 L22 L24-L28 = eagle-ltspice:L: INDUCTOR, European symbol; SPICEMODEL: NONE; SPICEPREFIX: L
L5-L7 L19 L20 = inductors:BLM15H: EMIFIL (R) Chip Ferrite Bead for GHz Noise Source: http://www.murata.com/ Ferrite Bead BLM15H.pdf
OPA_1-OPA_4 = My_Library_RADAR:OPA4703EA/250; COPYRIGHT: Copyright (C) 2025 Ultra Librarian. All rights reserved.; DATASHEET: https://www.ti.com/lit/gpn/opa4703; DESCRIPTION: Quad, 12-V, 1-MHz, low-offset operational amplifier 14-TSSOP -40 to 85; MANUFACTURER_NAME: Texas Instruments; MANUFACTURER_PART_NUMBER: OPA4703EA/250
R1 R13-R15 R22 R32 R36-R38 R174-R203 = rcl:R-EU_: RESISTOR, European symbol; SPICEPREFIX: R
R2-R12 R16-R21 R23-R31 R33-R35 R39-R173 = eagle-ltspice:R: RESISTOR, European symbol; SPICEMODEL: NONE; SPICEPREFIX: R
RF_SW_1-RF_SW_16 U$1 = My_Library_RADAR:M3SWA2-34DR+
S1 = SparkFun-Switches:MOMENTARY-SWITCH-SPST: Momentary Switch (Pushbutton) - SPST Normally-open (NO) SPST momentary switches (buttons, pushbuttons). Variants PTH-12MM - 12mm square, through-hole Momentary Pushbutton Switch - 12mm Square <https://www.sparkfun.com/products/9190> (COM-09190) PTH-6.0MM, PTH-6.0MM-KIT - 6.0mm square, through-hole Mini Pushbutton Switch <https://www.sparkfun.com/products/97> (COM-00097) KIT package intended for soldering kit's - only one side of pads' copper is exposed. PTH-RIGHT-ANGLE-KIT - Right-angle, through-hole Right Angle Tactile Button <https://www.sparkfun.com/products/10791> - Used on SparkFun BigTime Watch Kit <https://www.sparkfun.com/products/11734> SMD-12MM - 12mm square, surface-mount Tactile Button - SMD (12mm) <https://www.sparkfun.com/products/12993> (COM-12993) Used on SparkFun PicoBoard <https://www.sparkfun.com/products/11888> SMD-4.5MM - 4.5mm Square Trackball Switch Used on SparkFun Blackberry Trackballer Breakout <https://www.sparkfun.com/products/13169> SMD-4.6MMX2.8MM - 4.60mm x 2.80mm, surface mount Used on SparkFun Pro Micro - RP2040 <https://www.sparkfun.com/products/17717> SMD-5.2MM, SMD-5.2-REDUNDANT - 5.2mm square, surface-mount Mini Pushbutton Switch - SMD <https://www.sparkfun.com/products/8720> (COM-08720) Used on Arduino Pro Mini <https://www.sparkfun.com/products/11114> REDUNDANT package connects both switch circuits together SMD-6.0X3.5MM - 6.0 x 3.5mm, surface mount Momentary Reset Switch SMD <https://www.sparkfun.com/products/8229> (COM-08229) SMD-6.2MM-TALL - 6.2mm square, surface mount Tactile Button - SMD (6mm) <https://www.sparkfun.com/products/12992> Used on SparkFun Digital Sandbox <https://www.sparkfun.com/products/12651> SMD-RIGHT-ANGLE - Right-angle, surface mount Used on SparkFun Block for Intel® Edison - Arduino <https://www.sparkfun.com/products/13036>; PROD_ID: SWCH-15606
SJ1 = jumper:SJ2W: SMD solder JUMPER
SV1 = con-lstb:MA10-2: PIN HEADER; OC_FARNELL: unknown; OC_NEWARK: unknown
U1 = My_Library_RADAR:AD9484BCPZ-500; COPYRIGHT: Copyright (C) 2025 Ultra Librarian. All rights reserved.; DATASHEET: https://www.analog.com/media/en/technical-documentation/data-sheets/AD9484.pdf; DESCRIPTION: 8-Bit, 500 MSPS, 1.8 V Analog-to-Digital Converter; MANUFACTURER_NAME: Analog Devices Inc; MANUFACTURER_PART_NUMBER: AD9484BCPZ-500
U2 = My_Library:STM32F746ZGT7; COPYRIGHT: Copyright (C) 2024 Ultra Librarian. All rights reserved.; MANUFACTURER_PART_NUMBER: STM32F746ZGT7; MFR_NAME: STMicroelectronics
U3 = My_Library_2:AD9708AR; COPYRIGHT: Copyright (C) 2024 Ultra Librarian. All rights reserved.; MANUFACTURER_PART_NUMBER: AD9708AR; MFR_NAME: Analog Devices Inc
U4 U8 = My_Library_RADAR:AD8352ACPZ-R7; COPYRIGHT: Copyright (C) 2025 Ultra Librarian. All rights reserved.; DATASHEET: https://www.analog.com/media/en/technical-documentation/data-sheets/ad8352.pdf; DESCRIPTION: 2 GHz Ultralow Distortion Differential RF/IF Amplifier; MANUFACTURER_NAME: Analog Devices Inc; MANUFACTURER_PART_NUMBER: AD8352ACPZ-R7
U5 U13 = My_Library_RADAR:LTC5552IUDBTRMPBF; COPYRIGHT: Copyright (C) 2024 Ultra Librarian. All rights reserved.; MANUFACTURER_PART_NUMBER: LTC5552IUDB#TRMPBF; MFR_NAME: Analog Devices Inc
U6 = My_Library_RADAR:FT2232HQ; COPYRIGHT: Copyright (C) 2025 Ultra Librarian. All rights reserved.; MANUFACTURER_PART_NUMBER: FT2232HQ; MFR_NAME: FTDI, Future Technology Devices International Ltd
U7 U69 = My_Library_RADAR:DAC5578SRGET; COPYRIGHT: Copyright (C) 2025 Ultra Librarian. All rights reserved.; DATASHEET: https://www.ti.com/lit/gpn/dac5578; DESCRIPTION: 8-bit, Octal Channel, Ultra-Low Glitch, Voltage Output, 2-Wire Interface DAC 24-VQFN -40 to 125; MANUFACTURER_NAME: Texas Instruments; MANUFACTURER_PART_NUMBER: DAC5578SRGET
U9 = My_Library:MT25QL01GBBB8E12-0AUT; COPYRIGHT: Copyright (C) 2024 Ultra Librarian. All rights reserved.; MANUFACTURER_PART_NUMBER: MT25QL01GBBB8E12-0AUT; MFR_NAME: Micron
U10 U88 U89 = My_Library_RADAR:ADS7830IPWR; COPYRIGHT: Copyright (C) 2025 Ultra Librarian. All rights reserved.; DATASHEET: https://www.ti.com/lit/gpn/ads7830; DESCRIPTION: 8-Bit, 8-Channel Sampling A/D Converter with I2C Interface 16-TSSOP -40 to 85; MANUFACTURER_NAME: Texas Instruments; MANUFACTURER_PART_NUMBER: ADS7830IPWR
U11 U73-U87 = My_Library_RADAR:INA241A4IDGKR; COPYRIGHT: Copyright (C) 2025 Ultra Librarian. All rights reserved.; DESCRIPTION: -5-V to 110-V bidirectional ultraprecise current sense amplifier with enhanced PWM rejection 8-VSSOP -40 to 125; MANUFACTURER_NAME: Texas Instruments; MANUFACTURER_PART_NUMBER: INA241A4IDGKR; REFDES: RefDes; TYPE: TYPE
U14 U15 U17 U37-U41 U43-U68 = My_Library_RADAR:SZMMSZ5232BT1G; COPYRIGHT: Copyright (C) 2024 Ultra Librarian. All rights reserved.; MANUFACTURER_PART_NUMBER: SZMMSZ5232BT1G; MFR_NAME: onsemi
U16 = My_Library_RADAR:EP4RKU+; COPYRIGHT: Copyright (C) 2024 Ultra Librarian. All rights reserved.; MANUFACTURER_PART_NUMBER: EP4RKU+; MFR_NAME: Mini Circuits
U42 = XC7A50T-2FTG256I:XC7A50T-2FTG256I: Artix-7 Field Programmable Gate Array (FPGA) IC 170 2764800 52160 256-LBGA Check availability <https://pricing.snapeda.com/parts/XC7A50T-2FTG256I/Xilinx%20Inc./view-part?ref=eda>; AVAILABILITY: In Stock; CHECK_PRICES: https://www.snapeda.com/parts/XC7A50T-2FTG256I/Xilinx/view-part/?ref=eda; DESCRIPTION: Artix-7 Field Programmable Gate Array (FPGA) IC 170 2764800 52160 256-LBGA; MF: Xilinx Inc.; MP: XC7A50T-2FTG256I; PACKAGE: LBGA-256 Xilinx Inc.; PRICE: None; SNAPEDA_LINK: https://www.snapeda.com/parts/XC7A50T-2FTG256I/Xilinx/view-part/?ref=snap
U90 = My_Library_RADAR:TXS0104EPWR: 4-bit bidirectional voltage-level translator, auto-direction, TSSOP-14
U91 = My_Library_RADAR:TXS0102DCUR: 2-bit bidirectional voltage-level translator, auto-direction, VSSOP-8
U92 = My_Library_RADAR:TXS0104EPWR: 4-bit bidirectional voltage-level translator, auto-direction, TSSOP-14; DESCRIPTION: 4-bit bidirectional voltage-level translator, auto-direction, TSSOP-14; MANUFACTURER_NAME: Texas Instruments; MANUFACTURER_PART_NUMBER: TXS0104EPWR
X1 X4 X8-X10 X12 X16-X18 X20 X21 X24 X54-X56 X_1-X_16 = con-molex:22-23-2021: .100" (2.54mm) Center Header - 2 Pin; MF: MOLEX; MPN: 22-23-2021; OC_FARNELL: 1462926; OC_NEWARK: 25C3832
X2 X53 = con-cypressindustries:MINI-USB-: MINI USB-B Conector Source: www.cypressindustries.com; OC_FARNELL: unknown; OC_NEWARK: unknown
X3 X38-X52 = con-molex:22-23-2031: .100" (2.54mm) Center Header - 3 Pin; MF: MOLEX; MPN: 22-23-2031; OC_FARNELL: 1462950; OC_NEWARK: 30C0862
X6 X11 X13 X15 X19 X22 = con-molex:22-23-2031: .100" (2.54mm) Center Header - 3 Pin
X25-X27 X57 = con-molex:22-23-2021: .100" (2.54mm) Center Header - 2 Pin
XTAL1 XTAL3 = My_Library:NX3225GD-8MHZ-STD-CRA-3; COPYRIGHT: Copyright (C) 2024 Ultra Librarian. All rights reserved.; MANUFACTURER_PART_NUMBER: NX3225GD-8MHZ-STD-CRA-3; MFR_NAME: NDK
Y1 = SparkFun-Clocks:CRYSTAL-12MHZ: 12.0MHz Crystal Frequency: 12.0MHz Frequency Tolerance: ±20ppm Load Capacitance: 18pF SparkFun Products: SparkFun Logomatic <https://www.sparkfun.com/products/12772> Pocket AVR Programmer <https://www.sparkfun.com/products/9825>; PROD_ID: XTAL-15540

## Net classes
1 Differential: width 0.204 mm, drill 0.15 mm
2 Single_Ended Clocks & RF: width 0.204 mm, drill 0.15 mm